# EAGLE design FAL65816_ram (EAGLE 7.2.0)
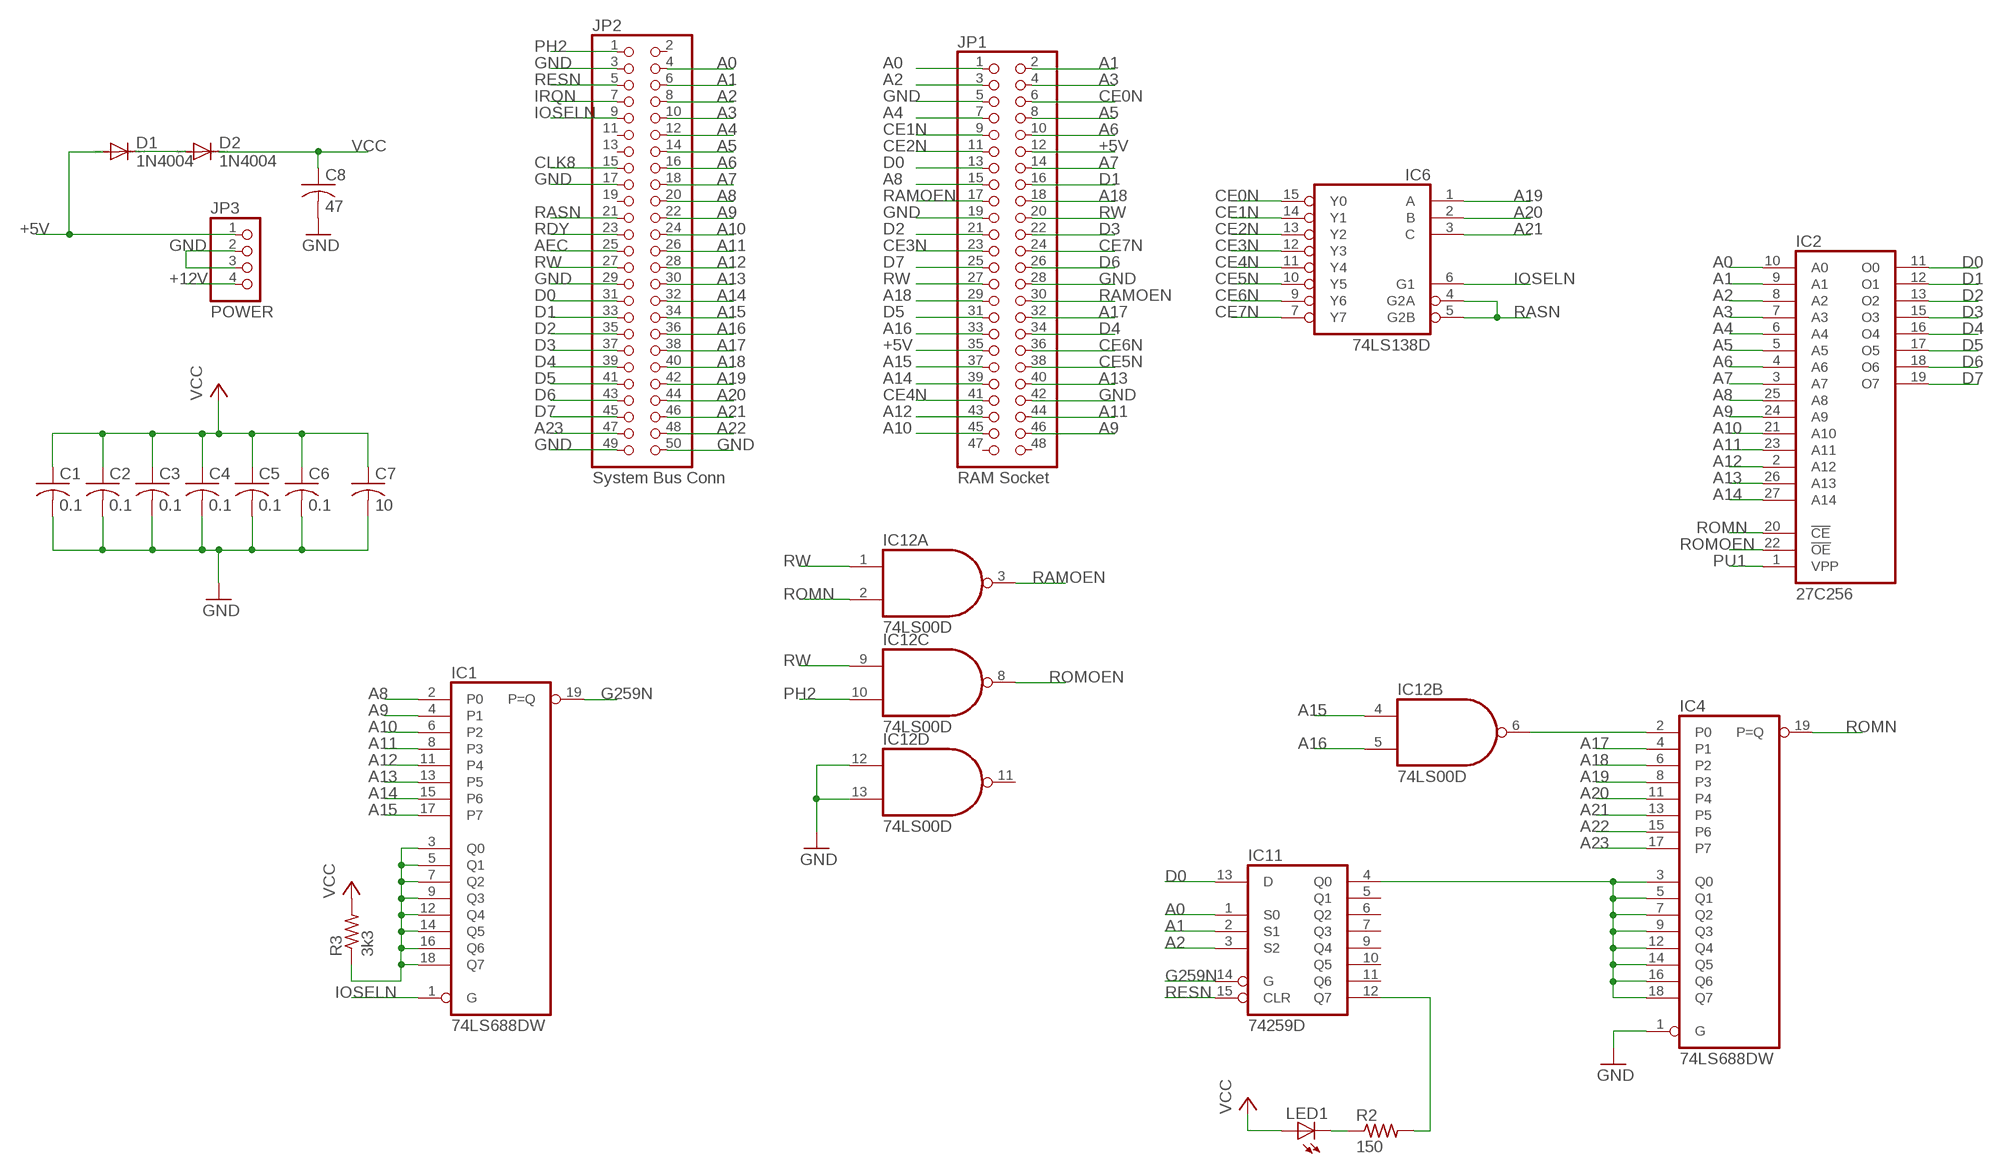
[diagram p0: schematic, sheet 1]

## Parts
C1  0.1  C-US050-024X044  [C050-024X044]
C2  0.1  C-US050-024X044  [C050-024X044]
C3  0.1  C-US050-024X044  [C050-024X044]
C4  0.1  C-US050-024X044  [C050-024X044]
C5  0.1  C-US050-024X044  [C050-024X044]
C6  0.1  C-US050-024X044  [C050-024X044]
C7  10  C-US050-024X044  [C050-024X044]
C8  47  C-US050-024X044  [C050-024X044]
D1  1N4004  [DO41-10]
D2  1N4004  [DO41-10]
IC1  74LS688DW  [SO20W]
IC2  27C256  27256  [DIL28]
IC4  74LS688DW  [SO20W]
IC6  74LS138D  [SO16]
IC11  74259D  [SO16]
IC12  74LS00D  [SO14]
JP1  RAM Socket  PINHD-2X24  [2X24]
JP2  System Bus Conn  PINHD-2X25/90  [2X25/90]
JP3  POWER  PINHD-1X4/90  [1X04/90]
LED1  LED5MM  [LED5MM]
R2  150  R-US_0204/7  [0204/7]
R3  3k3  R-US_0204/7  [0204/7]

## Nets
+5V: D1.A JP1.12 JP1.35 JP3.1
+12V: JP3.4
A0: IC2.10(A0) IC11.1(S0) JP1.1 JP2.4
A1: IC2.9(A1) IC11.2(S1) JP1.2 JP2.6
A2: IC2.8(A2) IC11.3(S2) JP1.3 JP2.8
A3: IC2.7(A3) JP1.4 JP2.10
A4: IC2.6(A4) JP1.7 JP2.12
A5: IC2.5(A5) JP1.8 JP2.14
A6: IC2.4(A6) JP1.10 JP2.16
A7: IC2.3(A7) JP1.14 JP2.18
A8: IC1.2(P0) IC2.25(A8) JP1.15 JP2.20
A9: IC1.4(P1) IC2.24(A9) JP1.46 JP2.22
A10: IC1.6(P2) IC2.21(A10) JP1.45 JP2.24
A11: IC1.8(P3) IC2.23(A11) JP1.44 JP2.26
A12: IC1.11(P4) IC2.2(A12) JP1.43 JP2.28
A13: IC1.13(P5) IC2.26(A13) JP1.40 JP2.30
A14: IC1.15(P6) IC2.27(A14) JP1.39 JP2.32
A15: IC1.17(P7) IC12.4(B:I0) JP1.37 JP2.34
A16: IC12.5(B:I1) JP1.33 JP2.36
A17: IC4.4(P1) JP1.32 JP2.38
A18: IC4.6(P2) JP1.18 JP1.29 JP2.40
A19: IC4.8(P3) IC6.1(A) JP2.42
A20: IC4.11(P4) IC6.2(B) JP2.44
A21: IC4.13(P5) IC6.3(C) JP2.46
A22: IC4.15(P6) JP2.48
A23: IC4.17(P7) JP2.47
AEC: JP2.25
CE0N: IC6.15(Y0) JP1.6
CE1N: IC6.14(Y1) JP1.9
CE2N: IC6.13(Y2) JP1.11
CE3N: IC6.12(Y3) JP1.23
CE4N: IC6.11(Y4) JP1.41
CE5N: IC6.10(Y5) JP1.38
CE6N: IC6.9(Y6) JP1.36
CE7N: IC6.7(Y7) JP1.24
CLK8: JP2.15
D0: IC2.11(O0) IC11.13(D) JP1.13 JP2.31
D1: IC2.12(O1) JP1.16 JP2.33
D2: IC2.13(O2) JP1.21 JP2.35
D3: IC2.15(O3) JP1.22 JP2.37
D4: IC2.16(O4) JP1.34 JP2.39
D5: IC2.17(O5) JP1.31 JP2.41
D6: IC2.18(O6) JP1.26 JP2.43
D7: IC2.19(O7) JP1.25 JP2.45
G259N: IC1.19(P=Q) IC11.14(G)
GND: C1.2 C2.2 C3.2 C4.2 C5.2 C6.2 C7.2 C8.2 IC4.1(G) IC12.12(D:I0) IC12.13(D:I1) JP1.5 JP1.19 JP1.28 JP1.42 JP2.3 JP2.17 JP2.29 JP2.49 JP2.50 JP3.2 JP3.3
IOSELN: IC1.1(G) IC6.6(G1) JP2.9
IRQN: JP2.7
N$1: IC4.3(Q0) IC4.5(Q1) IC4.7(Q2) IC4.9(Q3) IC4.12(Q4) IC4.14(Q5) IC4.16(Q6) IC4.18(Q7) IC11.4(Q0)
N$2: LED1.K(C) R2.1
N$3: IC11.12(Q7) R2.2
N$4: IC4.2(P0) IC12.6(B:O)
N$6: D1.C D2.A
PH2: IC12.10(C:I1) JP2.1
PU1: IC1.3(Q0) IC1.5(Q1) IC1.7(Q2) IC1.9(Q3) IC1.12(Q4) IC1.14(Q5) IC1.16(Q6) IC1.18(Q7) IC2.1(VPP) R3.1
RAMOEN: IC12.3(A:O) JP1.17 JP1.30
RASN: IC6.4(G2A) IC6.5(G2B) JP2.21
RDY: JP2.23
RESN: IC11.15(CLR) JP2.5
ROMN: IC2.20(!CE) IC4.19(P=Q) IC12.2(A:I1)
ROMOEN: IC2.22(!OE) IC12.8(C:O)
RW: IC12.1(A:I0) IC12.9(C:I0) JP1.20 JP1.27 JP2.27
VCC: C1.1 C2.1 C3.1 C4.1 C5.1 C6.1 C7.1 C8.1 D2.C LED1.A R3.2
Unconnected: IC11.5(Q1) IC11.6(Q2) IC11.7(Q3) IC11.9(Q4) IC11.10(Q5) IC11.11(Q6) IC12.11(D:O) JP1.47 JP1.48 JP2.2 JP2.11 JP2.13 JP2.19

## Power pins joined to a net without a drawn wire
GND: IC1.10(GND) IC2.14(GND) IC4.10(GND) IC6.8(GND) IC11.8(GND) IC12.7(P:GND)
VCC: IC1.20(VCC) IC2.28(VCC) IC4.20(VCC) IC6.16(VCC) IC11.16(VCC) IC12.14(P:VCC)

## Library data of the parts
C1-C8 = rcl:C-US: CAPACITOR, American symbol
D1 D2 = diode:1N4004: DIODE general purpose rectifier, 1 A
IC1 IC4 = FT74xx:74*688: 8-bit MAGNITUDE/IDENTITY COMPARATOR, totem pole
IC2 = memory:27256: MEMORY
IC6 = FT74xx:74*138: 3-line to 8-line DECODER/DEMULTIPLEXER
IC11 = 74xx-us:74*259: 8-bit addressable LATCH
IC12 = 74xx-us:74*00: Quad 2-input NAND gate
JP1 = pinhead:PINHD-2X24: PIN HEADER
JP2 = pinhead:PINHD-2X25: PIN HEADER
JP3 = pinhead:PINHD-1X4: PIN HEADER
LED1 = led:LED: LED OSRAM: - CHIPLED LG R971, LG N971, LY N971, LG Q971, LY Q971, LO R971, LY R971 LH N974, LH R974 LS Q976, LO Q976, LY Q976 LO Q996 - Hyper CHIPLED LW Q18S LB Q993, LB Q99A, LB R99A - SideLED LS A670, LO A670, LY A670, LG A670, LP A670 LB A673, LV A673, LT A673, LW A673 LH A674 LY A675 LS A676, LA A676, LO A676, LY A676, LW A676 LS A679, LY A679, LG A679 - Hyper Micro SIDELED® LS Y876, LA Y876, LO Y876, LY Y876 LT Y87S - SmartLED LW L88C, LW L88S LB L89C, LB L89S, LG L890 LS L89K, LO L89K, LY L89K LS L896, LA L896, LO L896, LY L896 - TOPLED LS T670, LO T670, LY T670, LG T670, LP T670 LSG T670, LSP T670, LSY T670, LOP T670, LYG T670 LG T671, LOG T671, LSG T671 LB T673, LV T673, LT T673, LW T673 LH T674 LS T676, LA T676, LO T676, LY T676, LB T676, LH T676, LSB T676, LW T676 LB T67C, LV T67C, LT T67C, LS T67K, LO T67K, LY T67K, LW E67C LS E67B, LA E67B, LO E67B, LY E67B, LB E67C, LV E67C, LT E67C LW T67C LS T679, LY T679, LG T679 LS T770, LO T770, LY T770, LG T770, LP T770 LB T773, LV T773, LT T773, LW T773 LH T774 LS E675, LA E675, LY E675, LS T675 LS T776, LA T776, LO T776, LY T776, LB T776 LHGB T686 LT T68C, LB T68C - Hyper Mini TOPLED® LB M676 - Mini TOPLED Santana® LG M470 LS M47K, LO M47K, LY M47K Source: http://www.osram.convergy.de LUXEON: - LUMILED® LXK2-PW12-R00, LXK2-PW12-S00, LXK2-PW14-U00, LXK2-PW14-V00 LXK2-PM12-R00, LXK2-PM12-S00, LXK2-PM14-U00 LXK2-PE12-Q00, LXK2-PE12-R00, LXK2-PE12-S00, LXK2-PE14-T00, LXK2-PE14-U00 LXK2-PB12-K00, LXK2-PB12-L00, LXK2-PB12-M00, LXK2-PB14-N00, LXK2-PB14-P00, LXK2-PB14-Q00 LXK2-PR12-L00, LXK2-PR12-M00, LXK2-PR14-Q00, LXK2-PR14-R00 LXK2-PD12-Q00, LXK2-PD12-R00, LXK2-PD12-S00 LXK2-PH12-R00, LXK2-PH12-S00 LXK2-PL12-P00, LXK2-PL12-Q00, LXK2-PL12-R00 Source: www.luxeon.com KINGBRIGHT: KA-3528ASYC Source: www.kingbright.com
R2 R3 = resistor:R-US_: RESISTOR, American symbol

## Board
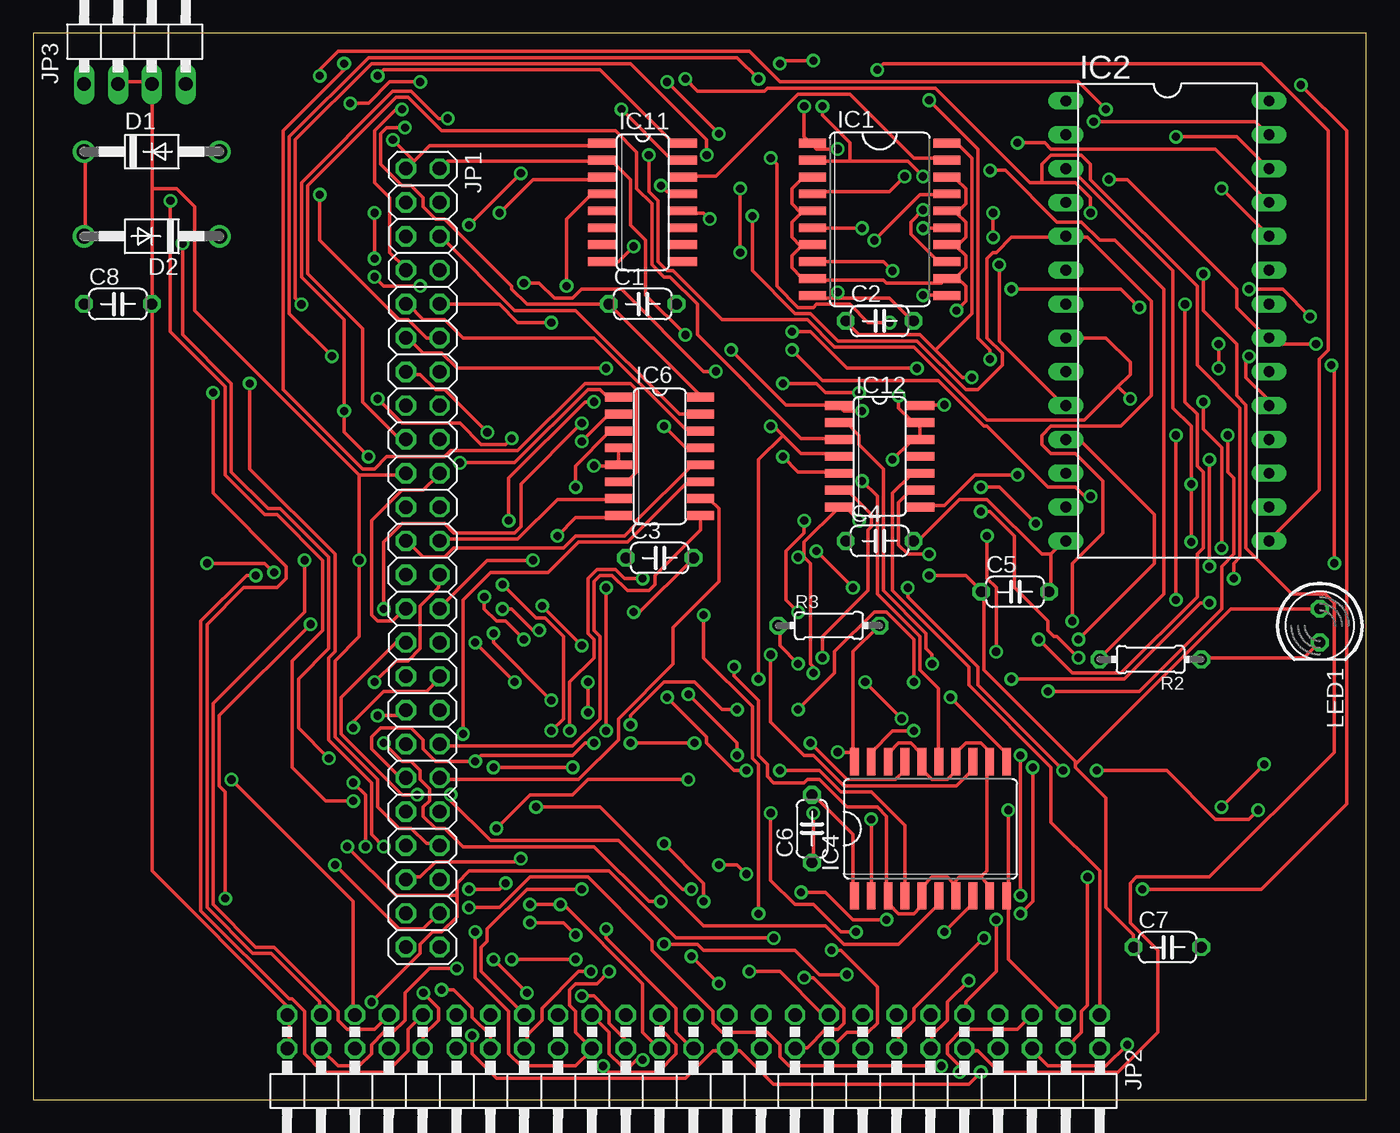
[diagram p1: board, top side]
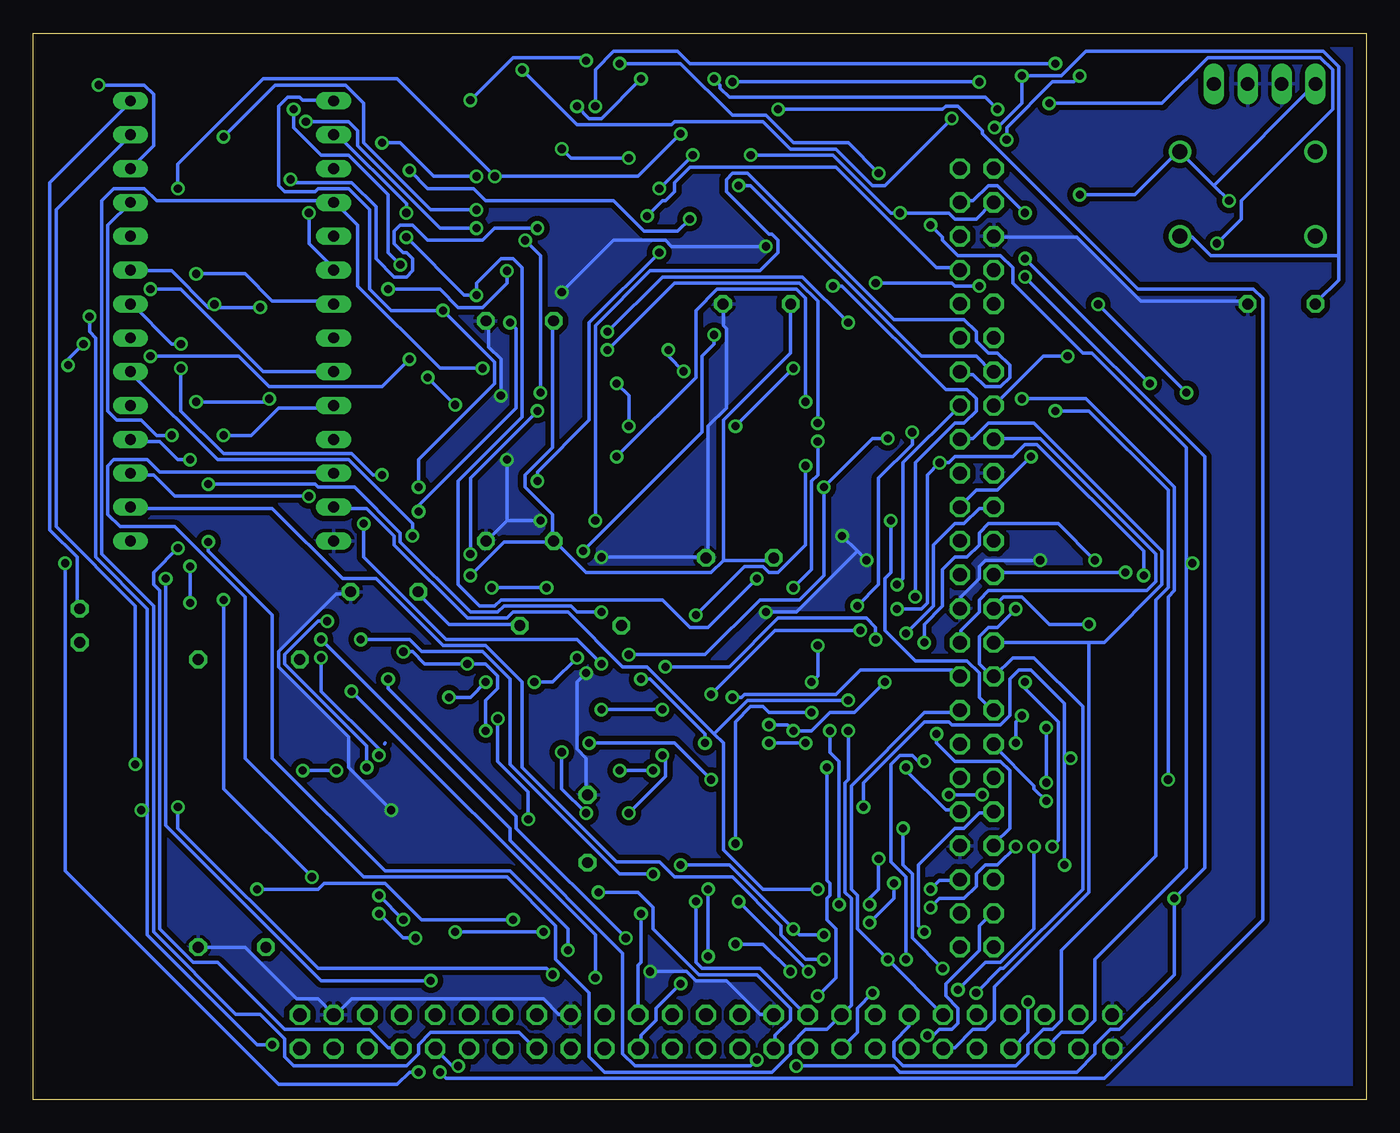
[diagram p2: board, bottom side, seen from below]

Size 100 x 80 mm. Coordinates in mm from the lower left corner, seen from the top.
Outline: 0,0 100,0 100,80 0,80 0,0
Copper layers (1*16): Top 0.035mm / dielectric 1.5mm / Bottom 0.035mm
Design rules "default": minimum track width 10mil, minimum drill 24mil, track to track 8mil, track to pad 8mil, pad to pad 8mil, via to via 8mil, smd to smd 8mil, copper to edge 40mil, drill to drill 8mil, minimum pad ring 10mil, minimum via ring 8mil, stop-mask expansion 4mil, vias tented up to drill 0mil, thermal gap 10mil

### Footprints (pad centres in the part's own frame; a part is rotated, then mirrored left to right if it is on the bottom)
C050-024X044 = drill 0.813 octagon: 1 -2.54,0; 2 2.54,0
DO41-10 = drill 1.118: A 5.08,0; C -5.08,0
SO20W = smd 0.66 x 2.032: 1 -5.715,-5.029; 2 -4.445,-5.029; 3 -3.175,-5.029; 4 -1.905,-5.029; 5 -0.635,-5.029; 6 0.635,-5.029; 7 1.905,-5.029; 8 3.175,-5.029; 9 4.445,-5.029; 10 5.715,-5.029; 11 5.715,5.029; 12 4.445,5.029; 13 3.175,5.029; 14 1.905,5.029; 15 0.635,5.029; 16 -0.635,5.029; 17 -1.905,5.029; 18 -3.175,5.029; 19 -4.445,5.029; 20 -5.715,5.029
DIL28 = drill 0.813 long: 1 -16.51,-7.62; 2 -13.97,-7.62; 3 -11.43,-7.62; 4 -8.89,-7.62; 5 -6.35,-7.62; 6 -3.81,-7.62; 7 -1.27,-7.62; 8 1.27,-7.62; 9 3.81,-7.62; 10 6.35,-7.62; 11 8.89,-7.62; 12 11.43,-7.62; 13 13.97,-7.62; 14 16.51,-7.62; 15 16.51,7.62; 16 13.97,7.62; 17 11.43,7.62; 18 8.89,7.62; 19 6.35,7.62; 20 3.81,7.62; 21 1.27,7.62; 22 -1.27,7.62; 23 -3.81,7.62; 24 -6.35,7.62; 25 -8.89,7.62; 26 -11.43,7.62; 27 -13.97,7.62; 28 -16.51,7.62
SO16 = smd 0.66 x 2.032: 1 -4.445,-3.073; 2 -3.175,-3.073; 3 -1.905,-3.073; 4 -0.635,-3.073; 5 0.635,-3.073; 6 1.905,-3.073; 7 3.175,-3.073; 8 4.445,-3.073; 9 4.445,3.073; 10 3.175,3.073; 11 1.905,3.073; 12 0.635,3.073; 13 -0.635,3.073; 14 -1.905,3.073; 15 -3.175,3.073; 16 -4.445,3.073
SO14 = smd 0.66 x 2.032: 1 -3.81,-3.073; 2 -2.54,-3.073; 3 -1.27,-3.073; 4 0,-3.073; 5 1.27,-3.073; 6 2.54,-3.073; 7 3.81,-3.073; 8 3.81,3.073; 9 2.54,3.073; 10 1.27,3.073; 11 0,3.073; 12 -1.27,3.073; 13 -2.54,3.073; 14 -3.81,3.073
2X24 = drill 1.016 octagon: 1 -27.94,-1.27; 2 -27.94,1.27; 3 -25.4,-1.27; 4 -25.4,1.27; 5 -22.86,-1.27; 6 -22.86,1.27; 7 -20.32,-1.27; 8 -20.32,1.27; 9 -17.78,-1.27; 10 -17.78,1.27; 11 -15.24,-1.27; 12 -15.24,1.27; 13 -12.7,-1.27; 14 -12.7,1.27; 15 -10.16,-1.27; 16 -10.16,1.27; 17 -7.62,-1.27; 18 -7.62,1.27; 19 -5.08,-1.27; 20 -5.08,1.27; 21 -2.54,-1.27; 22 -2.54,1.27; 23 0,-1.27; 24 0,1.27; 25 2.54,-1.27; 26 2.54,1.27; 27 5.08,-1.27; 28 5.08,1.27; 29 7.62,-1.27; 30 7.62,1.27; 31 10.16,-1.27; 32 10.16,1.27; 33 12.7,-1.27; 34 12.7,1.27; 35 15.24,-1.27; 36 15.24,1.27; 37 17.78,-1.27; 38 17.78,1.27; 39 20.32,-1.27; 40 20.32,1.27; 41 22.86,-1.27; 42 22.86,1.27; 43 25.4,-1.27; 44 25.4,1.27; 45 27.94,-1.27; 46 27.94,1.27; 47 30.48,-1.27; 48 30.48,1.27
2X25/90 = drill 1.016 octagon: 1 -29.21,-6.35; 2 -29.21,-3.81; 3 -26.67,-6.35; 4 -26.67,-3.81; 5 -24.13,-6.35; 6 -24.13,-3.81; 7 -21.59,-6.35; 8 -21.59,-3.81; 9 -19.05,-6.35; 10 -19.05,-3.81; 11 -16.51,-6.35; 12 -16.51,-3.81; 13 -13.97,-6.35; 14 -13.97,-3.81; 15 -11.43,-6.35; 16 -11.43,-3.81; 17 -8.89,-6.35; 18 -8.89,-3.81; 19 -6.35,-6.35; 20 -6.35,-3.81; 21 -3.81,-6.35; 22 -3.81,-3.81; 23 -1.27,-6.35; 24 -1.27,-3.81; 25 1.27,-6.35; 26 1.27,-3.81; 27 3.81,-6.35; 28 3.81,-3.81; 29 6.35,-6.35; 30 6.35,-3.81; 31 8.89,-6.35; 32 8.89,-3.81; 33 11.43,-6.35; 34 11.43,-3.81; 35 13.97,-6.35; 36 13.97,-3.81; 37 16.51,-6.35; 38 16.51,-3.81; 39 19.05,-6.35; 40 19.05,-3.81; 41 21.59,-3.81; 42 21.59,-6.35; 43 24.13,-3.81; 44 24.13,-6.35; 45 26.67,-3.81; 46 26.67,-6.35; 47 29.21,-3.81; 48 29.21,-6.35; 49 31.75,-3.81; 50 31.75,-6.35
1X04/90 = drill 1.016 long: 1 -3.81,-3.81; 2 -1.27,-3.81; 3 1.27,-3.81; 4 3.81,-3.81
LED5MM = drill 0.813 octagon: A -1.27,0; K 1.27,0
0204/7 = drill 0.813 octagon: 1 -3.81,0; 2 3.81,0

### Placement (x,y rotation side)
C1  45.72,59.69 0 top
C2  63.5,58.42 0 top
C3  46.99,40.64 0 top
C4  63.5,41.91 0 top
C5  73.66,38.1 0 top
C6  58.42,20.32 90 top
C7  85.09,11.43 0 top
C8  6.35,59.69 0 top
D1  8.89,71.12 0 top
D2  8.89,64.77 180 top
IC1  63.5,66.04 270 top
IC2  85.09,58.42 270 top
IC4  67.31,20.32 0 top
IC6  46.99,48.26 270 top
IC11  45.72,67.31 270 top
IC12  63.5,48.26 270 top
JP1  29.21,41.91 270 top
JP2  50.8,0 180 top
JP3  7.62,80.01 0 top
LED1  96.52,35.56 270 top
R2  83.82,33.02 180 top
R3  59.69,35.56 0 top

### Tracks (layer width: path | path; a pad name or v marks a point on that pad's centre or on a via)
+5V  (via drill 0.61)
  Top 0.254: v24,22.4 21.95,22.4 19.43,24.92 19.43,32.92 21.72,35.2 21.72,40.46 18.29,43.89 17.37,43.89 14.4,46.86 14.4,53.49 10.29,57.61 v10.29,67.44 | JP1.12 29.49,57.15 28.12,58.52 27.43,58.52 21.49,64.47 v21.49,67.89
  Bottom 0.254: v24,22.4 24.92,23.32 24.92,23.55 27.89,26.52 JP1.35 | 11.43,68.58 D1.A 14.17,71.09 17.37,67.89 v21.49,67.89 | 11.43,68.58 v10.29,67.44 | 11.43,68.58 JP3.1
A0  (via drill 0.61)
  Top 0.254: 28.57,70.41 28.12,69.95 JP1.1 | 28.57,70.41 29.72,71.55 42.52,71.55 IC11.1 | v85.72,37.49 v85.72,49.84 | v79.1,16.69 79.1,7.09 78.64,6.63 78.64,5.03 77.5,3.89 JP2.4 | v26.98,72.01 28.57,70.41 | v21.49,76.81 21.49,77.27 22.86,78.64 53.72,78.64 56.01,76.35 78.41,76.35 v80.47,74.3 | v72.47,62.64 72.47,56.92 77.27,52.12 IC2.10
  Bottom 0.254: v85.72,49.84 83.67,49.84 81.61,51.89 77.5,51.89 IC2.10 | v85.72,37.49 85.72,23.32 v79.1,16.69 | v26.98,72.01 26.98,72.92 23.55,76.35 21.95,76.35 v21.49,76.81 | v80.47,74.3 80.47,72.92 78.41,70.87 76.35,70.87 73.38,67.89 73.38,63.55 v72.47,62.64
A1  (via drill 0.61)
  Top 0.254: JP1.2 30.63,69.95 31.09,70.41 42.52,70.41 IC11.2 42.75,70.41 43.43,70.41 44.81,69.04 44.81,65.61 45.95,64.47 45.95,60.35 v48.92,57.38 | v91.21,60.81 93.73,60.81 v95.78,58.75 | v82.07,4.12 80.47,2.52 76.12,2.52 74.98,3.66 JP2.6 | v61.49,38.41 v58.75,41.15 | v65.61,38.41 65.61,37.72 70.87,32.46 70.87,31.09 v77.27,24.69 | v79.78,24.69 85.04,24.69 88.7,21.03 91.21,21.03 v91.9,21.72
  Bottom 0.254: v91.21,60.81 88.92,60.81 82.75,54.63 77.5,54.63 IC2.9 | v95.78,58.75 95.78,57.61 95.33,57.15 95.33,40.69 91.44,36.8 91.44,21.72 | 91.44,21.72 91.44,12.34 83.21,4.12 v82.07,4.12 | v48.92,57.38 48.92,56.69 49.84,55.78 49.84,50.06 v58.75,41.15 | v65.61,38.41 v61.49,38.41 | v79.78,24.69 v77.27,24.69 | 91.44,21.72 v91.9,21.72
A2  (via drill 0.61)
  Top 0.254: v34.98,66.52 37.49,69.04 42.52,69.04 IC11.3 | IC2.8 80.47,57.15 82.3,55.32 82.3,54.41 81.38,53.49 | 81.38,53.49 78.87,50.98 71.55,50.98 66.06,56.46 60.12,56.46 58.06,58.52 51.66,58.52 48.01,62.18 47.55,62.18 46.86,62.87 46.86,67.44 46.18,68.12 v46.18,70.87 | v89.15,41.38 89.15,48.92 87.78,50.29 v87.78,52.35 | 81.38,53.49 v82.3,52.58
  Bottom 0.254: JP1.3 28.12,67.21 29.26,66.06 30.86,66.06 31.32,66.52 v34.98,66.52 35.66,66.52 40.01,70.87 v46.18,70.87 | v89.15,41.38 90.98,39.55 90.98,38.63 90.53,38.18 90.53,12.8 88.01,10.29 86.18,10.29 81.15,5.26 74.75,5.26 73.38,3.89 72.47,3.89 JP2.8 | v87.78,52.35 82.53,52.35 v82.3,52.58
A3  (via drill 0.61)
  Top 0.254: v87.78,61.95 87.78,59.21 90.3,56.69 90.3,52.81 90.98,52.12 90.98,41.38 94.41,37.95 96.93,37.95 97.61,37.26 97.61,26.06 88.24,16.69 82.75,16.69 82.3,16.23 82.3,13.26 84.35,11.2 84.35,5.03 81.38,2.06 72.47,2.06 70.87,3.66 69.95,3.66 JP2.10 | v25.6,63.09 v25.6,66.52 | v16.23,53.72 16.23,47.32 22.63,40.92 22.63,33.6 22.17,33.15 22.17,26.98 25.38,23.77 25.38,19.89 v26.29,18.97 | v32.69,14.4 34.98,14.4 37.26,16.69 41.6,16.69 46.41,11.89 46.41,11.2 50.98,6.63 50.98,5.71 51.66,5.03 55.09,5.03 56.01,4.12 56.01,3.2 56.69,2.52 v68.12,2.52
  Bottom 0.254: v87.78,61.95 84.12,61.95 82.07,59.89 77.5,59.89 IC2.7 | v25.6,66.52 27.66,68.58 28.35,68.58 29.49,67.44 30.4,67.44 JP1.4 | v16.23,53.72 v25.6,63.09 | v26.29,18.97 27.66,17.6 28.57,17.6 29.26,16.92 29.26,16 30.18,15.09 32,15.09 v32.69,14.4 | v68.12,2.52 68.58,2.52 69.72,3.66 JP2.10
A4  (via drill 0.61)
  Top 0.254: v79.32,66.52 79.32,67.67 78.18,68.81 75.67,68.81 | 75.67,68.81 74.75,68.81 67.67,75.89 55.09,75.89 54.86,75.67 49.84,75.67 v48.92,76.58 | v27.66,74.3 27.2,74.3 25.6,72.69 25.6,68.81 26.75,67.67 26.75,63.55 27.89,62.41 JP1.7 | v70.18,8.91 68.58,7.32 68.58,5.94 67.44,4.8 67.44,3.89 JP2.12 | v90.07,39.09 90.07,40.23 90.53,40.69 90.53,51.89 87.33,55.09 87.33,61.04 79.32,69.04 79.32,70.18 78.64,70.87 76.35,70.87 75.67,70.18 75.67,68.81
  Bottom 0.254: v79.32,66.52 79.32,64.24 77.5,62.41 IC2.6 | v48.92,76.58 48.46,76.12 48.46,75.89 47.78,75.21 28.57,75.21 v27.66,74.3 | v70.18,8.91 78.41,8.91 90.07,20.57 v90.07,39.09
A5  (via drill 0.61)
  Top 0.254: v53.95,66.29 53.95,62.18 57.15,58.98 58.29,58.98 60.35,56.92 66.29,56.92 69.95,53.26 70.87,53.26 72.69,55.09 72.69,56.01 71.55,57.15 71.55,63.09 72.01,63.55 72.24,63.55 73.38,64.69 77.27,64.69 IC2.5 77.5,64.69 79.1,64.69 83.9,59.89 83.9,52.81 81.61,50.52 76.35,50.52 75.67,49.84 75.67,49.15 76.35,48.46 78.18,48.46 80.24,46.41 80.24,42.52 77.95,40.23 v77.95,35.89 | v71.32,12.12 66.06,6.86 66.06,5.94 64.92,4.8 64.92,3.89 JP2.14 | v74.07,13.95 74.98,14.86 v74.98,24.92
  Bottom 0.254: v53.95,66.29 52.81,67.44 52.58,67.44 51.89,68.12 51.89,68.81 50.75,69.95 39.78,69.95 32.23,62.41 30.63,62.41 JP1.8 | v71.32,12.12 72.24,12.12 v74.07,13.95 | v74.98,24.92 74.98,26.52 81.15,32.69 81.15,33.38 78.64,35.89 v77.95,35.89
A6  (via drill 0.61)
  Top 0.254: v38.86,58.29 36.35,58.29 34.98,59.66 30.63,59.66 JP1.10 | v56.92,57.61 58.29,57.61 61.04,54.86 v66.29,54.86
  Bottom 0.254: JP2.16 62.41,3.89 63.55,5.03 70.18,5.03 71.09,4.12 71.09,3.43 72.01,2.52 80.47,2.52 81.15,3.2 81.15,4.57 82.98,6.4 84.81,6.4 90.98,12.57 90.98,37.03 94.87,40.92 94.87,67.44 93.95,68.35 91.67,68.35 90.75,67.44 77.5,67.44 IC2.4 77.27,67.21 75.67,65.61 75.67,61.04 69.49,54.86 v66.29,54.86 | v38.86,58.29 42.29,61.72 52.81,61.72 v56.92,57.61
A7  (via drill 0.61)
  Top 0.254: v86.87,41.83 v86.87,46.18 86.87,50.52 85.5,51.89 85.5,62.18 77.95,69.72 77.5,69.72 IC2.3 | v59.89,11.2 60.58,11.2 63.32,8.46 63.32,5.71 62.64,5.03 61.04,5.03 59.89,3.89 JP2.18 | v57.84,43.43 57.84,42.52 56.46,41.15 56.46,37.49 v57.38,36.58
  Bottom 0.254: v86.87,41.83 86.87,41.15 82.07,36.35 82.07,25.6 73.61,17.14 64.24,17.14 59.89,12.8 v59.89,11.2 | v57.84,43.43 57.84,58.06 53.72,62.18 45.49,62.18 44.12,63.55 44.12,64.47 44.58,64.92 44.81,64.92 48.01,68.12 48.01,69.04 47.55,69.49 46.41,69.49 35.43,58.52 30.18,58.52 29.26,57.61 29.26,56.92 28.35,56.01 27.66,56.01 26.75,55.09 26.75,54.18 27.43,53.49 28.57,53.49 29.49,54.41 30.4,54.41 JP1.14 | v57.38,36.58 59.21,36.58 59.66,37.03 64.69,37.03 65.15,36.58 67.21,36.58 72.47,41.83 72.47,42.52 75.89,45.95 78.64,45.95 78.87,46.18 v86.87,46.18
A8  (via drill 0.61)
  Top 0.254: 61.27,70.41 65.61,70.41 v66.75,69.27 | 61.27,70.41 58.52,70.41 IC1.2 | v73.84,71.78 75.89,71.78 76.35,71.32 88.7,71.32 IC2.25 | v57.84,9.14 58.52,9.14 60.81,6.86 60.81,5.71 60.35,5.26 59.44,5.26 58.06,3.89 57.15,3.89 JP2.20 | v76.12,30.63 82.98,30.63 89.15,36.8 89.15,40.01 90.07,40.92 90.07,46.63 89.61,47.09 v89.61,49.84 | v22.4,55.78 19.2,58.98 19.2,72.24 25.15,78.18 52.81,78.18 v54.41,76.58 | v59.21,74.52 59.21,73.84 61.27,71.78 61.27,70.41
  Bottom 0.254: v66.75,69.27 69.95,69.27 72.47,71.78 v73.84,71.78 | v57.84,9.14 57.84,12.34 v76.12,30.63 | v89.61,49.84 90.75,49.84 91.9,50.98 93.73,50.98 94.41,51.66 94.41,65.61 IC2.25 | JP1.15 24.23,55.78 v22.4,55.78 | v54.41,76.58 57.38,73.61 58.29,73.61 v59.21,74.52
A9  (via drill 0.61)
  Top 0.254: v65.38,69.27 64.24,68.12 58.52,68.12 IC1.4 | v89.15,68.35 92.58,64.92 IC2.24 | v49.38,10.74 v51.44,8.69 | v49.38,15.77 48.69,15.77 42.52,21.95 v37.72,21.95 | v22.63,17.6 27.43,12.8 29.26,12.8 30.4,13.95 JP1.46 | v47.55,76.35 v51.44,72.47 | v29.03,76.35 26.75,76.35 25.15,74.75 v23.77,74.75 | v11.2,64.24 11.2,57.38 14.86,53.72 14.86,47.09 17.6,44.35 18.52,44.35 22.17,40.69 22.17,33.83 19.89,31.55 19.89,27.89 v22.17,25.6
  Bottom 0.254: v89.15,68.35 89.15,70.18 82.75,76.58 72.69,76.58 v65.38,69.27 54.63,69.27 v51.44,72.47 | v51.44,8.69 53.26,6.86 53.26,5.94 54.41,4.8 54.41,3.89 JP2.22 | v49.38,15.77 v49.38,10.74 | v37.72,21.95 37.72,23.77 33.15,28.35 31.32,28.35 31.09,28.12 27.43,28.12 26.75,28.8 26.75,31.55 26.06,32.23 25.15,32.23 22.63,29.72 22.63,25.6 | v22.63,17.6 22.63,25.6 | v29.03,76.35 v47.55,76.35 | v23.77,74.75 15.32,74.75 11.89,78.18 3.43,78.18 2.52,77.27 2.52,74.3 9.37,67.44 9.37,66.06 v11.2,64.24 | 22.63,25.6 v22.17,25.6
A10  (via drill 0.61)
  Top 0.254: v32.92,4.8 32.92,3.43 34.75,1.6 48.92,1.6 50.98,3.66 51.89,3.66 JP2.24 52.12,3.66 53.03,3.66 55.55,1.14 70.18,1.14 v71.09,2.06 | v62.18,65.38 58.52,65.38 IC1.6 | v80.7,69.04 82.07,69.04 90.3,60.81 90.3,59.44 92.58,57.15 IC2.21 92.81,57.15 93.27,56.69 v96.24,56.69 | v97.61,40.23 97.61,54.86 v97.38,55.09
  Bottom 0.254: v32.92,4.8 32.46,4.8 32,5.26 31.09,5.26 30.63,5.71 30.63,6.86 31.55,7.77 31.55,8.69 29.03,11.2 29.03,13.03 28.12,13.95 JP1.45 | v62.18,65.38 65.38,65.38 66.29,64.47 70.41,64.47 71.55,65.61 72.47,65.61 72.92,65.15 72.92,64.24 72.24,63.55 72.01,63.55 71.55,63.09 71.55,62.18 72.01,61.72 72.92,61.72 74.3,63.09 74.3,66.98 76.12,68.81 80.47,68.81 v80.7,69.04 | v71.09,2.06 71.78,2.06 72.69,1.14 81.61,1.14 97.61,17.14 v97.61,40.23 | v97.38,55.09 97.38,55.55 v96.24,56.69
A11  (via drill 0.61)
  Top 0.254: v32.69,15.77 34.98,15.77 v35.43,16.23 | v37.26,13.26 39.78,13.26 v40.69,12.34 | v42.98,12.8 42.98,12.12 48.23,6.86 48.23,5.03 49.38,3.89 JP2.26 | IC1.8 63.78,62.87 v64.47,62.18 | v73.38,60.81 81.61,60.81 v82.98,59.44 | v51.44,17.6 52.81,17.6 v53.49,16.92 | v75.44,34.52 77.95,32 81.61,32 87.33,37.72 87.33,40.92 87.78,41.38 87.78,47.09 87.33,47.55 87.33,51.44 86.41,52.35 v86.41,59.66
  Bottom 0.254: v32.69,15.77 32,16.46 30.63,16.46 JP1.44 | v35.43,16.23 35.43,15.09 v37.26,13.26 | v40.69,12.34 42.52,12.34 v42.98,12.8 47.78,17.6 v51.44,17.6 | v64.47,62.18 64.47,61.27 66.29,59.44 68.12,59.44 69.49,60.81 v73.38,60.81 | 86.41,59.44 86.87,59.44 89.61,62.18 92.58,62.18 IC2.23 | 86.41,59.44 v82.98,59.44 | v53.49,16.92 56.01,16.92 64.24,25.15 64.24,31.55 66.29,33.6 70.87,33.6 71.78,34.52 v75.44,34.52 | 86.41,59.44 v86.41,59.66
A12  (via drill 0.61)
  Top 0.254: v66.75,60.35 68.35,60.35 IC1.11 | v72.01,66.52 v72.01,64.69 | v36.58,18.06 36.35,17.83 30.18,17.83 29.03,16.69 28.12,16.69 JP1.43 | v37.26,14.63 v39.55,14.63 39.78,14.63 45.72,8.69 45.72,5.03 46.86,3.89 JP2.28 | v45.72,39.09 44.35,39.09 43.66,39.78 42.29,39.78 41.6,39.09 41.6,34.98 42.06,34.52 42.06,33.15 40.23,31.32 v40.23,27.66
  Bottom 0.254: v72.01,64.69 67.67,60.35 v66.75,60.35 66.75,61.27 64.92,63.09 64.01,63.09 63.32,62.41 63.32,51.21 68.12,46.41 68.12,38.63 66.52,37.03 65.38,37.03 64.92,37.49 52.81,37.49 50.75,35.43 49.38,35.43 v45.72,39.09 | v72.01,66.52 72.01,67.21 77.27,72.47 IC2.2 | v36.58,18.06 36.58,15.77 37.26,15.09 v37.26,14.63 | v40.23,27.66 40.23,26.06 39.55,25.38 v39.55,14.63
A13  (via drill 0.61)
  Top 0.254: v40.46,24.92 v34.52,24.92 | v41.15,7.77 42.06,7.77 43.2,6.63 43.2,5.71 44.35,4.57 44.35,3.89 JP2.30 | IC1.13 67.89,62.87 65.84,64.92 65.84,65.84 v66.75,66.75 | v85.72,72.24 90.3,72.24 92.58,69.95 IC2.26 | v57.61,15.54 59.44,15.54 61.49,13.49 v64.01,13.49 | v83.21,15.77 92.13,15.77 98.53,22.17 98.53,72.69 v95.1,76.12
  Bottom 0.254: v34.52,24.92 34.52,24.69 31.55,21.72 30.63,21.72 JP1.40 | v40.46,24.92 40.46,16.46 40.23,16.23 40.23,15.32 40.46,15.09 40.46,13.49 39.78,12.8 39.78,9.14 v41.15,7.77 | v66.75,66.75 70.18,66.75 75.21,71.78 75.21,74.75 76.58,76.12 81.84,76.12 v85.72,72.24 | v57.61,15.54 54.63,15.54 53.49,14.4 53.49,12.8 50.06,9.37 45.72,9.37 43.2,6.86 43.2,5.94 44.35,4.8 44.35,3.89 JP2.30 | v64.01,13.49 70.87,13.49 73.61,16.23 78.18,16.23 78.64,15.77 v83.21,15.77 | v95.1,76.12 91.67,76.12 90.98,75.44 90.98,71.55 92.58,69.95 IC2.26
A14  (via drill 0.61)
  Top 0.254: v66.75,65.38 68.35,65.38 IC1.15 | v79.55,73.38 91.67,73.38 92.58,72.47 IC2.27 | v33.15,12.57 33.15,9.14 35.66,6.63 35.66,3.43 36.58,2.52 40.69,2.52 41.83,3.66 JP2.32 40.69,5.03 40.69,6.63 40.23,7.09 40.23,8.23 40.69,8.69 42.29,8.69 v43.2,9.6 | v89.15,21.95 v92.35,25.15 | v61.04,9.37 58.98,9.37 57.15,11.2 50.29,11.2 49.84,11.66 v47.32,11.66
  Bottom 0.254: v66.75,65.38 69.49,65.38 75.67,71.55 75.67,72.69 76.35,73.38 v79.55,73.38 | v33.15,12.57 33.6,13.03 33.6,17.6 30.86,20.34 30.18,20.34 29.03,21.49 28.12,21.49 JP1.39 | v92.35,25.15 92.35,37.03 98.3,42.98 98.3,66.75 92.81,72.24 IC2.27 | v89.15,21.95 89.15,20.34 78.64,9.83 61.49,9.83 v61.04,9.37 | v47.32,11.66 45.26,11.66 v43.2,9.6
A15  (via drill 0.61)
  Top 0.254: 56.24,49.84 55.55,50.52 v55.32,50.52 | 56.24,49.84 57.61,48.46 60.35,48.46 IC12.4 | v56.24,53.72 58.75,53.72 59.44,53.03 v61.95,53.03 | v63.09,64.47 66.52,67.89 68.35,67.89 IC1.17 | v37.03,8 v34.52,10.52 | JP1.37 27.89,24.23 27.43,24.23 25.38,26.29 25.38,27.2 26.06,27.89 28.35,27.89 29.26,26.98 29.26,26.29 30.18,25.38 v33.15,25.38 33.6,25.83 40.46,25.83 41.38,26.75 v42.06,26.75 | 56.24,49.84 54.41,48.01 v54.41,31.55 | v44.81,26.75 v49.61,26.75
  Bottom 0.254: v55.32,50.52 55.32,52.81 v56.24,53.72 | v61.95,53.03 61.95,63.32 v63.09,64.47 | v33.15,25.38 33.6,25.38 34.06,25.83 34.98,25.83 35.66,25.15 35.66,17.83 34.52,16.69 v34.52,10.52 | v37.03,8 38.18,6.86 38.18,5.03 39.32,3.89 JP2.34 | v54.41,31.55 53.72,31.55 49.61,27.43 v49.61,26.75 | v42.06,26.75 v44.81,26.75
A16  (via drill 0.61)
  Top 0.254: v56.24,48.23 57.38,47.09 60.35,47.09 IC12.5 | v42.06,52.35 41.38,52.35 35.66,46.63 v35.66,43.43 | v41.83,9.6 40.92,9.6 38.18,6.86 38.18,5.94 37.03,4.8 37.03,3.89 JP2.36 | v47.09,14.86 46.18,14.86 42.06,18.97 32.23,18.97 30.86,20.34 30.18,20.34 29.26,21.26 29.26,21.95 29.72,22.4 29.72,23.32 29.03,24 29.03,24.69 28.35,25.38 27.66,25.38 v26.29,26.75 | v25.83,28.8 27.66,28.8 27.89,29.03 JP1.33
  Bottom 0.254: v56.24,48.23 50.29,54.18 50.29,59.21 48.69,60.81 42.75,60.81 42.06,60.12 v42.06,52.35 | v35.66,43.43 35.66,39.55 36.12,39.09 36.12,35.2 33.83,32.92 29.95,32.92 29.03,32 29.03,30.18 28.12,29.26 JP1.33 | v47.09,14.86 v41.83,9.6 | v26.29,26.75 26.29,28.35 v25.83,28.8
A17  (via drill 0.61)
  Top 0.254: v56.01,24.69 58.98,24.69 60.58,23.09 62.87,23.09 65.38,20.57 65.38,15.32 IC4.4 | v53.49,24.69 52.58,24.69 50.52,26.75 50.52,27.2 v47.55,30.18 | JP2.38 34.29,4.8 32.92,6.17 32.92,6.86 31.55,8.23 v30.63,8.23 | v24.92,18.97 24.92,22.86 v24,23.77 | v24,27.89 24,28.35 26.29,30.63 29.49,30.63 30.4,31.55 JP1.32
  Bottom 0.254: v53.49,24.69 v56.01,24.69 | v47.55,30.18 46.86,30.18 46.63,30.4 39.78,30.4 37.95,32.23 31.09,32.23 30.63,31.77 JP1.32 | v30.63,8.23 28.57,10.29 27.43,10.29 24.92,12.8 v24.92,18.97 | v24,27.89 v24,23.77
A18  (via drill 0.61)
  Top 0.254: v31.32,22.86 31.32,22.4 34.29,19.43 43.89,19.43 50.29,13.03 59.44,13.03 60.81,11.66 64.92,11.66 67.89,14.63 67.89,15.09 IC4.6 | v28.8,22.86 27.66,22.86 23.09,27.43 23.09,30.18 27.2,34.29 JP1.29
  Bottom 0.254: v28.8,22.86 v31.32,22.86 | JP1.29 20.8,34.29 | 20.8,34.29 19.66,34.29 15.32,38.63 15.32,41.15 24.92,50.75 28.35,50.75 29.49,49.61 30.4,49.61 JP1.18 | 20.8,34.29 20.8,15.54 27.89,8.46 27.89,5.94 28.57,5.26 29.49,5.26 30.86,3.89 31.55,3.89 JP2.40
A19  (via drill 0.61)
  Top 0.254: v32,47.78 36.12,47.78 41.6,53.26 42.52,53.26 42.98,52.81 43.89,52.81 IC6.1 | v16.69,39.32 16,39.32 12.57,35.89 12.57,14.17 19.2,7.54 19.43,7.54 20.34,6.63 20.34,3.43 21.72,2.06 26.52,2.06 28.12,3.66 28.12,5.26 JP2.42 | v68.35,12.57 70.41,14.63 70.41,15.09 IC4.8 | v61.72,12.57 60.58,12.57 58.52,14.63 57.15,14.63 55.32,16.46 v55.32,21.49 | v52.81,25.83 52.81,26.75 v49.15,30.4 | v37.95,35.2 37.49,35.2 35.89,36.8 v35.2,36.8
  Bottom 0.254: v16.69,39.32 16.69,41.15 24.69,49.15 25.6,49.15 26.52,48.23 30.86,48.23 31.32,47.78 v32,47.78 32.92,46.86 32.92,37.26 33.38,36.8 v35.2,36.8 | v61.72,12.57 v68.35,12.57 | v55.32,21.49 52.58,24.23 52.58,25.6 v52.81,25.83 | v49.15,30.4 44.35,35.2 v37.95,35.2
A20  (via drill 0.61)
  Top 0.254: IC6.2 43.2,51.44 v41.15,49.38 | v42.98,27.66 v42.98,38.41 | v33.15,34.29 v36.12,31.32 | v20.34,40.46 20.34,36.58 13.49,29.72 13.49,14.63 16.69,11.43 18.06,11.43 22.86,6.63 22.86,5.94 23.55,5.26 25.6,5.26 26.52,6.17 JP2.44 | v68.81,30.18 72.92,26.06 72.92,25.38 IC4.11 | v66.06,31.32 66.06,34.52 64.01,36.58 63.09,36.58 60.12,33.6 60.12,32 v57.38,29.26 | v52.81,29.26 51.66,29.26 49.61,31.32 47.32,31.32 44.81,28.8 v44.81,28.12
  Bottom 0.254: v41.15,49.38 41.15,46.86 41.6,46.41 41.6,39.78 v42.98,38.41 | v36.12,31.32 38.41,29.03 40.23,29.03 41.6,27.66 v42.98,27.66 43.43,28.12 v44.81,28.12 | v33.15,34.29 33.15,35.66 31.77,37.03 31.77,39.78 30.86,40.69 29.95,40.69 29.03,41.6 29.03,42.52 28.35,43.2 23.09,43.2 v20.34,40.46 | v68.81,30.18 67.21,30.18 v66.06,31.32 | v52.81,29.26 v57.38,29.26
A21  (via drill 0.61)
  Top 0.254: v55.32,33.38 55.32,28.35 57.84,25.83 58.52,25.83 60.81,23.55 69.27,23.55 70.41,24.69 70.41,25.15 IC4.13 | v40.69,45.95 40.69,47.55 43.2,50.06 43.89,50.06 IC6.3 | v14.86,24 24,14.86 24,6.4 JP2.46 | v25.83,52.58 27.66,50.75 32,50.75 33.6,49.15 35.43,49.15 v35.89,49.61
  Bottom 0.254: v55.32,33.38 49.61,33.38 45.49,37.49 42.52,37.49 40.69,39.32 v40.69,45.95 37.03,49.61 v35.89,49.61 | v14.86,24 14.86,37.72 14.4,38.18 14.4,45.95 21.03,52.58 v25.83,52.58
A22  (via drill 0.61)
  Top 0.254: v62.18,46.41 63.32,45.26 63.32,37.95 66.52,34.75 66.52,32.23 67.89,30.86 67.89,25.38 IC4.15 | v53.03,68.35 v53.03,63.55 | v50.52,70.87 50.52,72.01 44.81,77.72 25.38,77.72 19.66,72.01 19.66,60.12 v20.12,59.66 | v13.49,53.03 13.49,45.49 18.97,40.01 18.97,39.09 18.29,38.41 15.77,38.41 13.03,35.66 13.03,14.4 16.46,10.97 17.83,10.97 21.49,7.32 21.49,6.4 JP2.48
  Bottom 0.254: v62.18,46.41 62.18,47.09 58.29,50.98 58.29,58.29 v53.03,63.55 | v50.52,70.87 v53.03,68.35 | v13.49,53.03 v20.12,59.66
A23  (via drill 0.61)
  Top 0.254: v58.29,26.75 61.04,24 64.69,24 65.38,24.69 65.38,25.15 IC4.17 | v49.15,24 41.6,24 40.46,22.86 37.26,22.86 v34.75,20.34 | v31.77,9.83 29.72,9.83 27.89,8 27.89,5.94 26.98,5.03 26.29,5.03 25.38,4.12 25.38,3.43 24.46,2.52 22.86,2.52 21.72,3.66 JP2.47
  Bottom 0.254: v58.29,26.75 51.89,26.75 v49.15,24 | v34.75,20.34 34.75,17.6 34.06,16.92 34.06,12.12 v31.77,9.83
CE0N
  Top 0.254: IC6.15 48.46,51.44 40.69,59.21 36.12,59.21 30.63,64.69 JP1.6
CE1N
  Top 0.254: IC6.14 50.06,50.29 48.92,50.29 42.06,57.15 32.23,57.15 30.86,58.52 29.26,58.52 28.12,59.66 JP1.9
CE2N  (via drill 0.61)
  Top 0.254: v47.32,50.52 48.92,48.92 50.06,48.92 IC6.13 | v42.98,54.86 31.77,54.86 30.63,56.01 29.26,56.01 28.12,57.15 JP1.11
  Bottom 0.254: v42.98,54.86 v47.32,50.52
CE3N
  Top 0.254: IC6.12 50.06,47.55 49.38,47.55 45.26,43.43 45.26,43.2 44.35,42.29 40.69,42.29 39.78,41.38 31.55,41.38 30.86,40.69 29.26,40.69 28.12,41.83 JP1.23
CE4N  (via drill 0.61)
  Top 0.254: v32.23,27.43 32.23,37.49 34.29,39.55 38.63,39.55 40.92,41.83 44.58,41.83 48.92,46.18 50.06,46.18 IC6.11
  Bottom 0.254: v32.23,27.43 32.23,26.75 30.86,25.38 27.43,25.38 26.75,24.69 26.75,20.34 27.89,19.2 JP1.41
CE5N
  Top 0.254: IC6.10 50.06,45.03 50.75,45.03 51.44,44.35 51.44,38.86 48.01,35.43 48.01,32.69 43.89,28.57 43.89,26.98 40.92,24 30.63,24 JP1.38
CE6N
  Top 0.254: IC6.9 50.06,42.75 46.63,39.32 46.63,38.63 46.18,38.18 44.58,38.18 43.43,39.32 42.52,39.32 42.06,38.86 42.06,35.2 42.52,34.75 42.52,28.57 40.46,26.52 30.63,26.52 JP1.36
CE7N
  Top 0.254: IC6.7 43.89,45.03 39.32,45.03 36.35,42.06 30.63,42.06 JP1.24
D0  (via drill 0.61)
  Top 0.254: v47.09,68.58 47.55,68.12 48.69,68.12 IC11.13 | v78.41,34.52 84.12,40.23 84.12,43.89 78.64,49.38 77.5,49.38 IC2.11 | v45.72,2.97 45.26,2.97 44.81,2.52 44.12,2.52 43.2,3.43 43.2,5.03 42.06,6.17 JP2.31 | v34.06,50.06 30.86,53.26 30.18,53.26 29.03,54.41 28.12,54.41 JP1.13 | v41.15,34.06 v38.18,37.03 | v41.6,29.03 v41.6,31.32 | v47.32,19.2 50.29,16.23 v50.29,14.86
  Bottom 0.254: v47.09,68.58 46.18,68.58 33.38,55.78 29.26,55.78 28.12,54.63 JP1.13 | v78.41,34.52 64.24,20.34 64.24,19.43 55.78,10.97 55.78,3.43 54.86,2.52 46.18,2.52 v45.72,2.97 | v34.06,50.06 34.06,49.15 36.58,46.63 36.58,38.63 v38.18,37.03 | v41.15,34.06 41.15,31.77 v41.6,31.32 | v41.6,29.03 44.81,29.03 45.26,29.49 46.18,29.49 47.32,28.35 v47.32,19.2 | v50.29,14.86 50.29,10.29 49.84,9.83 45.49,9.83 42.06,6.4 JP2.31
D1  (via drill 0.61)
  Top 0.254: v35.2,38.63 37.72,36.12 38.41,36.12 39.78,34.75 39.78,28.57 v38.86,27.66
  Bottom 0.254: IC2.12 77.5,47.09 90.53,47.09 91.44,48.01 93.95,48.01 94.41,47.55 94.41,43.89 93.5,42.98 89.38,42.98 84.12,37.72 84.12,25.6 75.21,16.69 64.47,16.69 60.81,13.03 60.81,10.52 58.29,8 58.29,3.2 57.15,2.06 44.58,2.06 43.2,3.43 43.2,4.12 42.06,5.26 40.46,5.26 JP2.33 38.63,7.09 38.63,15.09 39.09,15.54 39.09,23.77 38.86,24 v38.86,27.66 | v35.2,38.63 34.75,39.09 34.75,47.78 30.63,51.89 JP1.16
D2  (via drill 0.61)
  Top 0.254: v41.15,15.77 37.03,15.77 34.06,12.8 34.06,11.89 33.6,11.43 33.6,9.6 36.8,6.4 JP2.35 | v34.52,34.98 34.52,34.29 v38.86,29.95
  Bottom 0.254: 48.92,27.43 48.23,26.75 48.23,18.75 45.26,15.77 v41.15,15.77 | 48.92,27.43 53.95,32.46 55.78,32.46 59.89,36.58 64.01,36.58 64.47,36.12 67.44,36.12 72.92,41.6 72.92,42.29 74.98,44.35 77.27,44.35 IC2.13 | v34.52,34.98 32.46,37.03 32.46,41.6 30.86,43.2 30.18,43.2 29.03,44.35 28.12,44.35 JP1.21 | v38.86,29.95 46.41,29.95 48.92,27.43
D3  (via drill 0.61)
  Top 0.254: v63.32,77.27 63.78,77.72 92.13,77.72 97.16,72.69 97.16,56.24 96.47,55.55 96.47,45.72 92.81,42.06 IC2.15 | v31.09,73.61 30.4,73.61 28.35,75.67 26.98,75.67 20.12,68.81 20.12,61.72 23.32,58.52 v23.32,51.66 23.32,50.06 v25.15,48.23
  Bottom 0.254: v63.32,77.27 59.21,73.15 52.12,73.15 51.89,73.38 45.26,73.38 43.2,71.32 39.78,71.32 37.03,68.58 36.12,68.58 v31.09,73.61 | v25.15,48.23 27.66,45.72 29.26,45.72 30.4,44.58 JP1.22 | JP2.37 34.29,5.49 35.43,4.34 35.43,3.2 34.75,2.52 26.29,2.52 25.38,3.43 25.38,4.12 24.23,5.26 23.55,5.26 22.86,5.94 22.86,11.2 15.77,18.29 15.77,37.49 14.86,38.41 14.86,45.72 20.8,51.66 v23.32,51.66
D4  (via drill 0.61)
  Top 0.254: v35.89,10.52 v40.69,10.52
  Bottom 0.254: v40.69,10.52 42.06,10.52 43.89,12.34 43.89,13.03 47.55,16.69 51.89,16.69 53.03,17.83 56.24,17.83 63.32,24.92 63.32,31.32 66.06,34.06 69.27,34.06 74.3,39.09 76.81,39.09 82.07,44.35 92.58,44.35 IC2.16 | JP2.39 31.77,6.4 v35.89,10.52 38.18,12.8 38.18,15.32 38.63,15.77 38.63,23.55 33.15,29.03 30.63,29.03 JP1.34
D5  (via drill 0.61)
  Top 0.254: v79.32,45.26 78.87,45.26 78.18,45.95 76.12,45.95 71.55,50.52 71.32,50.52 67.89,53.95 59.21,53.95 v56.92,56.24 | v41.15,50.75 36.58,46.18 36.58,42.98 36.12,42.52 31.55,42.52 30.86,43.2 27.66,43.2 26.29,41.83 v26.29,36.8 | v29.26,8 30.4,6.86 30.4,5.94 29.26,4.8 29.26,3.89 JP2.41
  Bottom 0.254: v79.32,45.26 89.38,45.26 90.98,46.86 92.58,46.86 IC2.17 | v56.92,56.24 51.89,61.27 42.52,61.27 41.15,59.89 v41.15,50.75 | v26.29,36.8 27.66,35.43 28.35,35.43 29.03,34.75 29.03,32.69 28.12,31.77 JP1.31 27.89,31.77 26.52,33.15 24.92,33.15 21.26,29.49 21.26,15.77 27.2,9.83 27.43,9.83 v29.26,8
D6  (via drill 0.61)
  Top 0.254: v88.24,40.01 v88.24,48.01 | v88.24,37.26 87.55,37.26 81.84,31.55 v73.38,31.55 | v55.55,12.12 48.23,12.12 43.2,17.14 32.69,17.14 31.77,16.23 31.77,15.32 | 31.77,15.32 31.77,13.72 30.63,12.57 29.95,12.57 29.03,11.66 29.03,10.97 v25.38,7.32 | v25.6,31.32 27.2,32.92 28.12,32.92 29.03,33.83 29.03,37.03 30.4,38.41 30.4,39.32 JP1.26 | v23.55,18.97 27.2,15.32 31.77,15.32
  Bottom 0.254: v88.24,48.01 89.15,48.01 90.53,49.38 92.58,49.38 IC2.18 | v88.24,37.26 v88.24,40.01 | v73.38,31.55 73.38,30.86 63.78,21.26 63.78,20.34 v55.55,12.12 | v25.38,7.32 25.38,5.03 26.52,3.89 JP2.43 | v25.6,31.32 25.6,30.86 23.09,28.35 23.09,19.43 v23.55,18.97
D7  (via drill 0.61)
  Top 0.254: v91.21,55.78 90.98,55.55 90.98,54.18 92.58,52.58 92.58,52.12 IC2.19 | v71.78,55.55 71.78,56.24 70.87,57.15 70.87,71.32 v67.21,74.98 | v58.52,77.95 56.24,77.95 v56.01,77.72 | v32.69,65.61 v36.58,69.49 | v18.06,39.55 17.37,40.23 v13.03,40.23
  Bottom 0.254: v91.21,55.78 84.58,55.78 82.3,53.49 73.84,53.49 v71.78,55.55 | v67.21,74.98 64.01,78.18 58.75,78.18 v58.52,77.95 | v56.01,77.72 51.44,77.72 47.55,73.84 45.03,73.84 42.98,71.78 38.86,71.78 v36.58,69.49 | v32.69,65.61 31.77,64.69 31.77,64.47 30.63,63.32 27.43,63.32 26.52,62.41 26.52,61.27 21.26,56.01 20.57,56.01 13.49,48.92 13.49,40.23 | 13.49,40.23 13.49,17.37 20.34,10.52 20.34,5.94 21.26,5.03 22.86,5.03 24,3.89 JP2.45 | v18.06,39.55 27.89,39.55 JP1.25 | 13.49,40.23 v13.03,40.23
G259N
  Top 0.254: IC11.14 48.92,69.27 51.21,69.27 57.38,75.44 61.27,75.44 66.06,70.64 68.35,70.64 IC1.19
GND  (via drill 0.61)
  Top 0.254: v53.72,9.6 56.01,9.6 59.21,6.4 59.66,6.4 JP2.17 | JP2.3 77.27,6.4 73.15,10.52 73.15,15.09 IC4.10 73.15,15.32 v73.15,21.72 | 60.35,60.12 64.24,60.12 65.84,58.52 C2.2 | 60.35,60.12 58.52,60.12 IC1.10 | IC11.8 43.89,62.87 v45.03,64.01 | 60.35,60.12 v60.35,60.58 | IC4.1 61.49,15.32 61.49,19.89 58.52,22.86 C6.2 | 76.35,40.92 76.35,38.18 C5.2 | 76.35,40.92 77.27,41.83 IC2.14 | v61.95,43.43 61.04,44.35 60.58,44.35 IC12.7 60.35,44.35 57.84,41.83 57.84,40.69 | v64.47,48.01 65.84,49.38 66.52,49.38 IC12.12 66.52,49.61 66.52,50.75 IC12.13 66.52,50.98 65.84,50.98 64.92,51.89 v64.92,52.81 | 76.35,40.92 75.67,40.92 71.55,45.03 69.49,45.03 66.52,42.06 66.06,42.06 C4.2 | v58.52,32 58.52,32.46 58.29,32.69 58.29,40.23 57.84,40.69 | 57.84,40.69 v57.38,40.69 | v39.32,42.29 40.69,43.66 43.89,43.66 IC6.8 | v37.49,40.46 34.06,40.46 30.63,37.03 JP1.28 | JP2.49 19.2,3.89 19.2,6.17 JP2.50 18.97,6.4 18.97,7.09 8.91,17.14 8.91,59.66 C8.2 8.91,59.89 8.91,68.35 | 8.91,68.35 8.91,76.12 JP3.3 8.69,76.35 6.4,76.35 JP3.2 | 24.46,46.86 27.89,46.86 JP1.19 | 24.46,46.86 12.12,59.21 12.12,66.98 10.74,68.35 8.91,68.35 | 24.46,46.86 v24.46,40.46 24.46,34.75 22.63,32.92 22.63,27.2 25.83,24 25.83,21.95 27.43,20.34 28.35,20.34 29.49,19.2 30.4,19.2 JP1.42 | v45.03,36.58 45.49,36.58 49.38,40.46 C3.2
  Bottom 0.254: v53.72,9.6 50.98,9.6 50.29,8.91 48.01,8.91 45.49,6.4 44.58,6.4 JP2.29 | C7.2 84.12,11.43 80.24,7.54 78.64,7.54 77.5,6.4 JP2.3 77.27,6.4 76.12,7.54 61.72,7.54 60.58,6.4 59.89,6.4 JP2.17 | v45.03,64.01 52.12,64.01 52.58,64.47 56.46,64.47 v60.35,60.58 | C1.2 48.23,59.66 48.23,58.06 48.01,57.84 48.01,51.89 49.38,50.52 49.38,40.69 C3.2 49.61,40.69 v57.38,40.69 | 64.47,43.43 v61.95,43.43 | 64.47,43.43 65.84,42.06 C4.2 | 64.47,43.43 v64.47,48.01 | v58.52,32 59.21,31.32 59.21,26.29 58.52,25.6 58.52,22.86 C6.2 | v64.92,52.81 64.92,55.55 65.84,56.46 65.84,58.29 C2.2 | v73.15,21.72 76.35,24.92 76.35,27.2 81.61,32.46 81.61,33.6 77.27,37.95 76.35,37.95 C5.2 | v37.49,40.46 38.18,41.15 | 38.18,41.15 v39.32,42.29 | JP1.5 27.89,64.69 21.72,64.69 16.92,59.89 8.91,59.89 C8.2 | v24.46,40.46 28.57,40.46 29.03,40.01 29.03,39.09 30.4,37.72 30.4,37.03 JP1.28 | v45.03,36.58 42.75,36.58 38.18,41.15
  pour Bottom (isolate 0.406): 0,80.01 100.33,80.01 100.33,0 0,0
IOSELN  (via drill 0.61)
  Top 0.254: v23.32,77.72 23.32,77.27 18.75,72.69 18.75,53.26 24.69,47.32 25.6,47.32 26.52,48.23 30.86,48.23 31.32,48.69 36.35,48.69 41.38,53.72 44.81,53.72 45.26,53.26 45.26,47.09 44.58,46.41 44.12,46.41 IC6.6 | v57.84,74.52 57.84,72.24 58.29,71.78 IC1.1 58.52,71.55 58.75,71.32 v60.35,71.32 | v72.24,13.49 72.24,9.6 69.95,7.32 69.95,6.4 JP2.9 | v74.07,25.83 v74.07,15.32 | v78.41,33.15 76.81,34.75 76.58,34.75 76.12,35.2 76.12,35.89 73.61,38.41 73.61,42.29 71.78,44.12 v71.09,44.12 | v64.24,58.29 62.64,58.29 61.27,59.66 58.75,59.66 58.52,59.44 57.38,59.44 55.78,61.04 55.78,70.18 v55.32,70.64
  Bottom 0.254: v23.32,77.72 50.75,77.72 51.66,78.64 56.46,78.64 57.84,77.27 v57.84,74.52 | v74.07,15.32 v72.24,13.49 | v74.07,25.83 74.07,26.29 78.41,30.63 v78.41,33.15 | v71.09,44.12 71.09,44.58 63.78,51.89 63.78,57.84 v64.24,58.29 | v55.32,70.64 59.66,70.64 v60.35,71.32
N$1  (via drill 0.61)
  Top 0.254: IC4.18 64.24,25.38 64.24,26.06 64.92,26.75 65.84,26.75 66.52,26.06 66.52,25.38 IC4.16 66.75,25.15 66.75,24.69 67.44,24 68.58,24 69.04,24.46 69.04,25.15 IC4.14 69.27,25.38 69.27,26.06 69.95,26.75 71.09,26.75 71.55,26.29 71.55,25.38 IC4.12 71.55,25.15 71.55,17.14 71.09,16.69 | v40.01,61.04 40.01,66.06 41.83,67.89 42.52,67.89 IC11.4 | v33.83,37.72 33.83,36.8 34.75,35.89 35.43,35.89 v36.8,34.52 | v52.58,32.46 52.58,31.77 54.41,29.95 54.41,25.83 55.09,25.15 55.09,24.23 55.55,23.77 57.84,23.77 58.06,24 58.98,24 61.04,21.95 63.32,21.95 64.01,21.26 64.01,15.32 IC4.3 64.24,15.09 64.24,14.63 64.92,13.95 66.06,13.95 66.52,14.4 66.52,15.09 IC4.5 66.75,15.32 66.75,16 67.44,16.69 68.58,16.69 69.04,16.23 | 69.04,16.23 69.04,15.32 IC4.7 69.04,16.23 | 71.09,16.69 71.55,16.23 71.55,15.32 IC4.9 | 71.09,16.69 69.49,16.69 69.04,16.23
  Bottom 0.254: v40.01,61.04 39.32,61.04 31.55,53.26 29.95,53.26 29.26,52.58 29.26,51.66 30.18,50.75 30.86,50.75 33.83,47.78 v33.83,37.72 | v36.8,34.52 36.8,35.43 37.49,36.12 44.12,36.12 47.78,32.46 v52.58,32.46
N$2
  Top 0.254: R2.1 87.78,33.15 95.33,33.15 96.47,34.29 LED1.K
N$3  (via drill 0.61)
  Top 0.254: v50.75,66.06 50.29,66.52 48.92,66.52 IC11.12 | v71.78,69.72 72.92,69.72 76.81,65.84 78.64,65.84 80.01,64.47 81.15,64.47 84.81,60.81 84.81,37.95 80.01,33.15 R2.2
  Bottom 0.254: v50.75,66.06 51.66,65.15 54.18,65.15 56.46,67.44 66.06,67.44 66.98,68.35 70.41,68.35 v71.78,69.72
N$4  (via drill 0.61)
  Top 0.254: v62.87,21.03 IC4.2 | v62.41,31.32 v65.15,28.57 | v59.21,33.15 59.21,34.75 62.64,38.18 62.64,42.75 62.87,42.98 62.87,43.89 61.04,45.72 IC12.6
  Bottom 0.254: v62.87,21.03 62.87,23.09 65.15,25.38 v65.15,28.57 | v62.41,31.32 61.04,31.32 v59.21,33.15
N$6
  Top 0.254: D2.A 3.89,64.92 3.89,71.09 D1.C
PH2
  Top 0.254: JP2.1 80.01,17.14 76.35,20.8 76.35,24.92 70.18,31.09 70.18,32.46 64.47,38.18 64.47,45.49 65.84,46.86 66.52,46.86 IC12.10
PU1  (via drill 0.61)
  Top 0.254: 57.61,64.01 56.92,63.32 56.92,62.41 57.61,61.72 58.29,61.72 IC1.9 58.52,61.49 63.78,61.49 64.01,61.27 68.12,61.27 68.35,61.49 IC1.12 | 57.61,64.01 58.29,64.01 IC1.7 57.61,64.01 | 57.61,66.52 58.29,66.52 IC1.5 57.61,66.52 | 57.61,66.52 56.92,65.84 56.92,64.69 57.61,64.01 | 57.61,66.52 56.92,67.21 56.92,68.35 57.61,69.04 58.29,69.04 IC1.3 | 69.27,61.72 68.58,61.72 IC1.12 | 69.27,61.72 69.95,62.41 69.95,63.32 69.27,64.01 | 69.27,64.01 68.58,64.01 IC1.14 69.27,64.01 | 69.27,66.52 68.58,66.52 IC1.16 69.27,66.52 | 69.27,66.52 69.95,65.84 69.95,64.69 69.27,64.01 | 69.27,66.52 69.95,67.21 69.95,68.35 69.27,69.04 68.58,69.04 IC1.18 | v57.38,32.69 56.01,34.06 56.01,35.43 R3.1 | v75.21,43.2 72.47,45.95 v71.09,45.95 | v69.27,59.21 69.95,59.89 69.95,61.04 69.27,61.72 | 69.27,61.72 IC1.12
  Bottom 0.254: v57.38,32.69 59.21,34.52 69.04,34.52 75.21,40.69 v75.21,43.2 | v71.09,45.95 71.09,48.01 65.38,53.72 65.38,55.32 v69.27,59.21 73.15,59.21 74.75,60.81 74.75,66.75 76.35,68.35 78.64,68.35 78.87,68.12 81.15,68.12 81.61,68.58 81.61,74.52 80.92,75.21 80.01,75.21 79.78,74.98 77.5,74.98 IC2.1
RAMOEN
  Top 0.254: IC12.3 60.35,49.61 57.61,49.61 49.84,57.38 49.84,59.66 47.78,61.72 47.32,61.72 46.41,62.64 46.41,67.21 45.26,68.35 45.26,71.09 43.66,72.69 30.63,72.69 28.12,75.21 27.2,75.21 20.57,68.58 20.57,61.95 24.69,57.84 24.69,52.35 27.43,49.61 27.89,49.61 JP1.17
  Bottom 0.254: JP1.30 30.4,34.29 30.4,35.2 29.03,36.58 29.03,37.49 28.35,38.18 16.46,38.18 15.77,38.86 15.77,40.92 24.46,49.61 27.89,49.61 JP1.17
RASN  (via drill 0.61)
  Top 0.254: IC6.4 43.89,48.69 43.89,47.78 IC6.5 43.89,47.55 v42.06,47.55 | v50.29,36.35 50.29,33.15 53.95,29.49 53.95,25.6 54.41,25.15 v54.41,13.95
  Bottom 0.254: v42.06,47.55 42.06,41.6 44.12,39.55 44.81,39.55 45.26,40.01 46.63,40.01 v50.29,36.35 | v54.41,13.95 54.41,10.29 54.63,10.06 54.63,6.4 JP2.21
RESN  (via drill 0.61)
  Top 0.254: v44.12,74.3 47.78,70.64 48.69,70.64 IC11.15 | v69.49,2.06 69.49,2.52 68.58,3.43 68.58,4.12 69.72,5.26 73.84,5.26 JP2.5
  Bottom 0.254: v44.12,74.3 31.77,74.3 31.55,74.52 30.63,74.52 28.8,72.69 28.8,72.47 17.14,60.81 8.46,60.81 7.77,60.12 7.77,13.49 19.66,1.6 69.04,1.6 v69.49,2.06
ROMN  (via drill 0.61)
  Top 0.254: IC4.19 62.87,26.06 64.47,27.66 v66.06,27.66 | v67.44,32.69 67.44,33.38 66.98,33.83 66.98,34.98 63.78,38.18 63.78,47.32 61.95,49.15 61.95,49.84 61.04,50.75 60.58,50.75 IC12.2 | v71.55,42.29 71.55,39.09 72.24,38.41 v72.24,33.6
  Bottom 0.254: v66.06,27.66 66.06,29.95 65.15,30.86 65.15,31.77 66.06,32.69 v67.44,32.69 70.64,32.69 71.55,33.6 v72.24,33.6 | v71.55,42.29 71.55,43.2 76.35,48.01 86.18,48.01 92.58,54.41 IC2.20
ROMOEN  (via drill 0.61)
  Top 0.254: v73.84,46.86 70.64,46.86 68.35,44.58 66.75,44.58 IC12.8 | v88.92,56.69 v88.92,54.86
  Bottom 0.254: v73.84,46.86 74.52,46.86 76.12,48.46 85.72,48.46 88.92,51.66 v88.92,54.86 | v88.92,56.69 89.61,56.69 92.58,59.66 IC2.22
RW  (via drill 0.61)
  Top 0.254: IC12.9 65.84,45.72 64.92,44.81 64.92,41.6 65.61,40.92 v67.21,40.92 | v62.18,51.66 60.81,51.66 60.58,51.89 IC12.1 60.35,52.12 56.46,52.12 v52.35,56.24 | JP1.27 27.89,36.8 26.98,35.89 25.83,35.89 25.38,36.35 25.38,43.43 27.66,45.72 29.26,45.72 30.4,46.86 JP1.20 | v42.75,2.52 43.2,2.06 46.86,2.06 48.23,3.43 48.23,4.12 47.09,5.26 47.09,6.17 JP2.27 | v14.4,15.09 14.4,23.09 13.95,23.55 13.95,28.8 v20.8,35.66 | v51.21,54.63 50.29,54.63 44.12,60.81 41.15,60.81 40.46,60.12 39.09,60.12 37.95,61.27 v36.8,61.27 | v29.03,61.04 26.29,61.04 v25.6,61.72
  Bottom 0.254: v67.21,40.92 67.21,46.63 v62.18,51.66 | v42.75,2.52 35.43,2.52 34.98,2.06 21.72,2.06 20.34,3.43 20.34,4.12 19.2,5.26 18.52,5.26 14.4,9.37 v14.4,15.09 12.12,17.37 12.12,48.23 v25.6,61.72 | v20.8,35.66 23.77,35.66 25.83,37.72 27.2,37.72 27.89,37.03 JP1.27 | v52.35,56.24 52.35,55.78 v51.21,54.63 | v36.8,61.27 31.09,61.27 30.86,61.04 v29.03,61.04
VCC  (via drill 0.61)
  Top 0.254: v25.83,76.81 26.29,77.27 42.52,77.27 48.01,71.78 48.69,71.78 IC11.16 | v68.35,52.12 66.75,52.12 IC12.14 | v70.41,54.18 69.72,54.18 67.67,56.24 | 67.67,56.24 66.52,57.38 61.95,57.38 61.04,58.29 C2.1 | 67.67,56.24 70.41,58.98 70.41,70.64 69.49,71.55 68.58,71.55 IC1.20 | IC6.16 50.06,52.81 C1.1 42.98,59.66 37.03,59.66 35.89,60.81 35.89,61.04 30.86,66.06 30.18,66.06 29.26,66.98 29.26,67.67 28.35,68.58 27.66,68.58 26.06,70.18 26.06,72.47 26.52,72.92 v27.89,72.92 | 61.49,26.06 61.49,33.6 63.32,35.43 R3.2 | 61.49,26.06 61.49,25.38 IC4.20 61.49,26.06 | v58.52,21.49 58.52,17.83 C6.1 | 61.49,26.06 v60.35,26.06 | 78.18,25.15 78.18,25.38 71.32,32.23 71.32,37.95 C5.1 71.09,38.18 69.95,39.32 v67.21,39.32 | 78.18,25.15 78.18,24.92 80.47,22.63 80.47,14.4 82.53,12.34 82.53,11.43 C7.1 | 78.18,25.15 89.84,36.8 96.47,36.8 LED1.A
  Bottom 0.254: 2.06,63.32 2.06,61.49 3.66,59.89 C8.1 | 2.06,63.32 2.06,77.5 3.2,78.64 21.03,78.64 22.86,76.81 v25.83,76.81 25.83,74.75 27.66,72.92 v27.89,72.92 | 2.06,63.32 11.66,63.32 13.03,64.69 13.95,64.69 D2.C | v70.41,54.18 v68.35,52.12 | 48.23,40.46 44.58,40.46 C3.1 | 48.23,40.46 49.15,39.55 58.52,39.55 60.81,41.83 C4.1 | 48.23,40.46 48.23,50.98 43.2,56.01 43.2,59.66 C1.1 | C2.1 61.04,58.29 61.04,48.92 63.09,46.86 63.09,45.95 61.04,43.89 61.04,42.06 C4.1 | v58.52,21.49 60.35,23.32 v60.35,26.06 | IC2.28 92.81,74.75 98.75,68.81 98.75,42.75 96.7,40.69 96.7,37.03 LED1.A | R3.2 63.55,35.66 68.81,35.66 71.09,37.95 C5.1 | v67.21,39.32 64.69,41.83 61.04,41.83 C4.1
VDD
  Bottom 0.254: 73.61,26.75 73.66,26.67